# EasyEDA schematic Power_logger.json
TITLE: Sheet_1; REV: 1.0; Date: 2021-02-03; Sheet: 1/1; Drawn By: Jhon_Velasquez; Company: Your Company
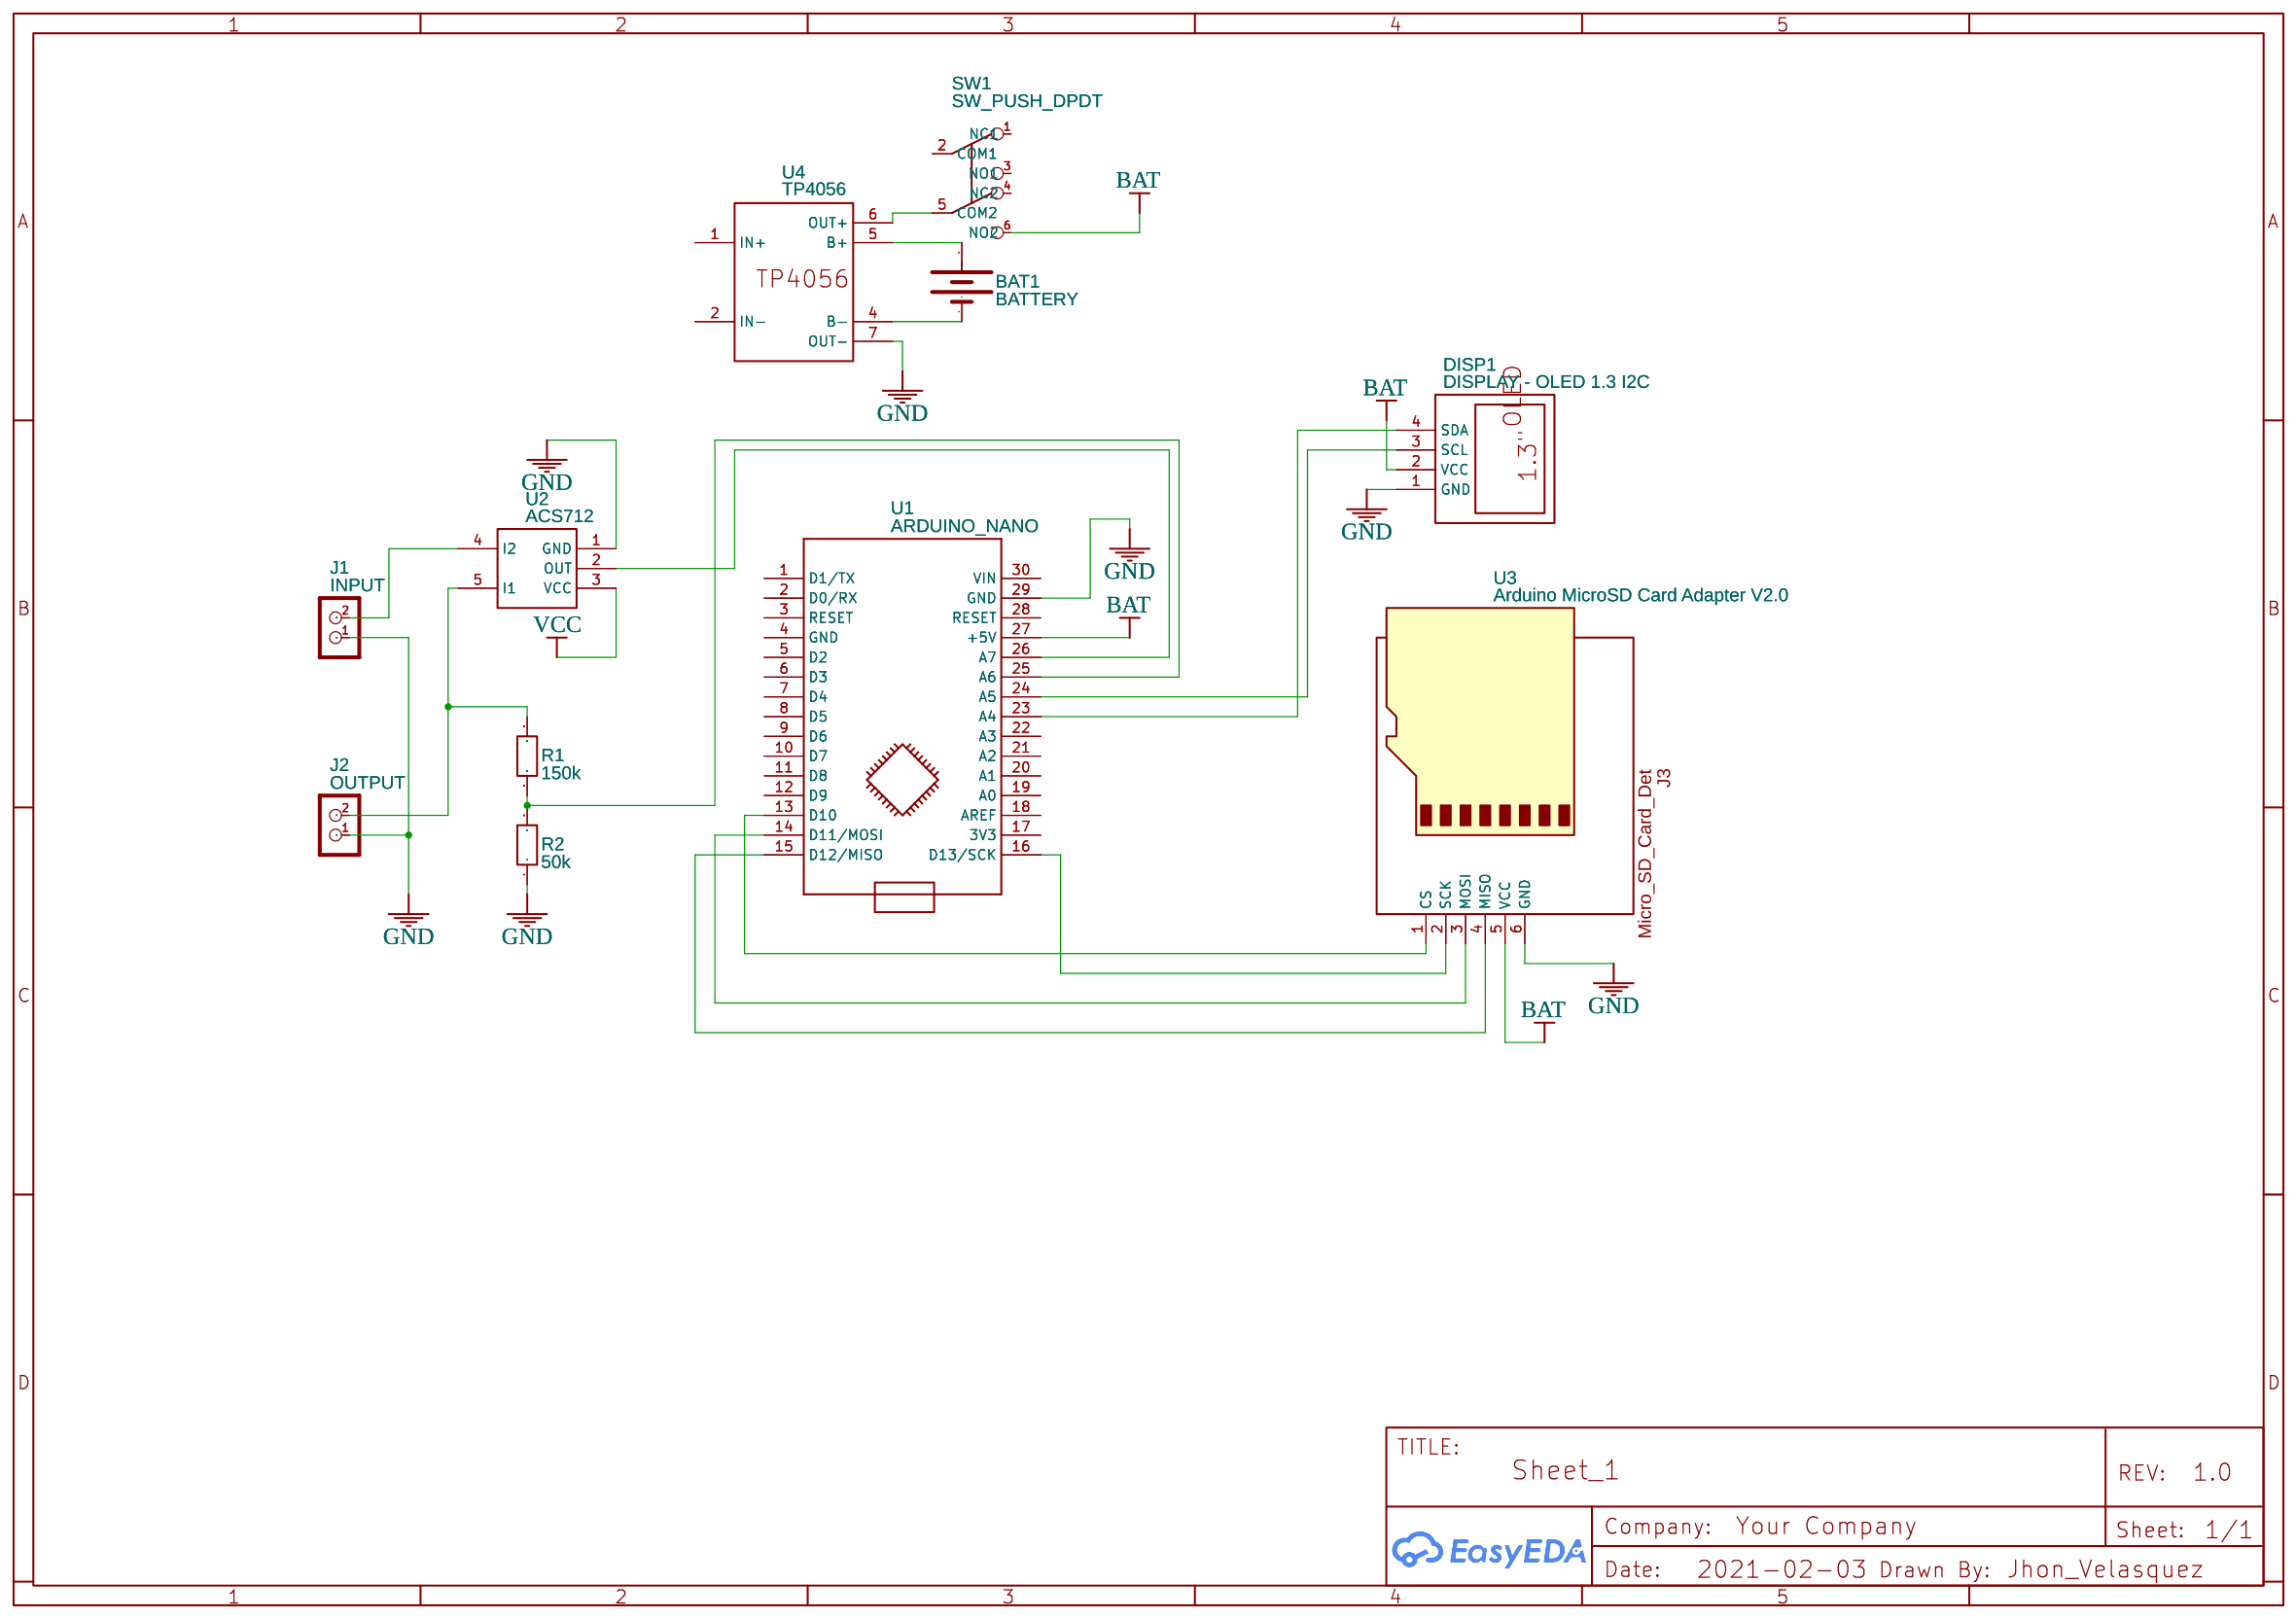
[diagram p0: schematic sheet]

## Parts
BAT1  BATTERY  [LIPO-110-TABS]
DISP1  DISPLAY - OLED 1.3 I2C  [DISPLAY - OLED 1.3 I2C]
J1  INPUT  [TERMINAL_BLOCK_2P_5]
J2  OUTPUT  [TERMINAL_BLOCK_2P_5]
R1  150k  [AXIAL-1.0]
R2  50k  [AXIAL-1.0]
SW1  SW_PUSH_DPDT  [SW_PUSH_BUTTON_MINI]
U1  ARDUINO_NANO  [ARDUINO_NANO]
U2  ACS712  [ACS712]
U3  Arduino MicroSD Card Adapter V2.0  [ARDUINO MICROSD CARD ADAPTER MODULE]
U4  TP4056  [TP4056-PROTECT]

## Library data of the parts
BAT1 = BATTERY: Contributor: SparkFun
DISP1 = DISPLAY - OLED 1.3 I2C: Contributor: jettetsoi; Package Display: No
J1 J2 = CON_TERMINAL_BLOCK_02: Contributor: DangerousPrototype; Package Display: No
R1 R2 = Res_AXIAL-1.0(3W)_EU: Package Display: No
SW1 = SW_PUSH_DPDT: Contributor: DangerousPrototype
U1 = ARDUINO_NANO: sourceId: KGSeAWhDB
U2 = ACS712: Contributor: Ronald Rezal
U3 = Arduino MicroSD Card Adapter V2.0: Contributor: yasir4fm
U4 = TP4056: Manufacturer Part: TP4056-protect; link: https://dlnmh9ip6v2uc.cloudfront.net/datasheets/Prototyping/TP4056.pdf; Contributor: Артем Куницын

## Nets
GND: DISP1.1(GND) J1.1 J2.1 R2.1 U1.29(GND) U2.1(GND) U3.6(GND) U4.7(OUT-)
VCC: U2.3(VCC)
BAT: DISP1.2(VCC) SW1.6(NO2) U1.27(+5V) U3.5(VCC)
Net-(BAT1-+): BAT1.+ U4.5(B+)
Net-(BAT1--): BAT1.- U4.4(B-)
Net-(DISP1-3): DISP1.3(SCL) U1.24(A5)
Net-(DISP1-4): DISP1.4(SDA) U1.23(A4)
Net-(J1-2): J1.2 U2.4(I2)
Net-(J2-2): J2.2 R1.2 U2.5(I1)
Net-(R1-1): R1.1 R2.2 U1.25(A6)
Net-(SW1-5): SW1.5(COM2) U4.6(OUT+)
Net-(U1-13): U1.13(D10) U3.1(CS)
Net-(U1-14): U1.14(D11/MOSI) U3.3(MOSI)
Net-(U1-15): U1.15(D12/MISO) U3.4(MISO)
Net-(U1-16): U1.16(D13/SCK) U3.2(SCK)
Net-(U1-26): U1.26(A7) U2.2(OUT)

Not connected (* = marked no-connect by the designer): SW1 1(NC1) 2(COM1) 3(NO1) 4(NC2); U1 1(D1/TX) 2(D0/RX) 3(RESET) 4(GND) 5(D2) 6(D3) 7(D4) 8(D5) 9(D6) 10(D7) 11(D8) 12(D9) 17(3V3) 18(AREF) 19(A0) 20(A1) 21(A2) 22(A3) 28(RESET) 30(VIN); U4 1(IN+) 2(IN-)
